# Altium schematic sheet RadiationMainSheet.SchDoc
size A4
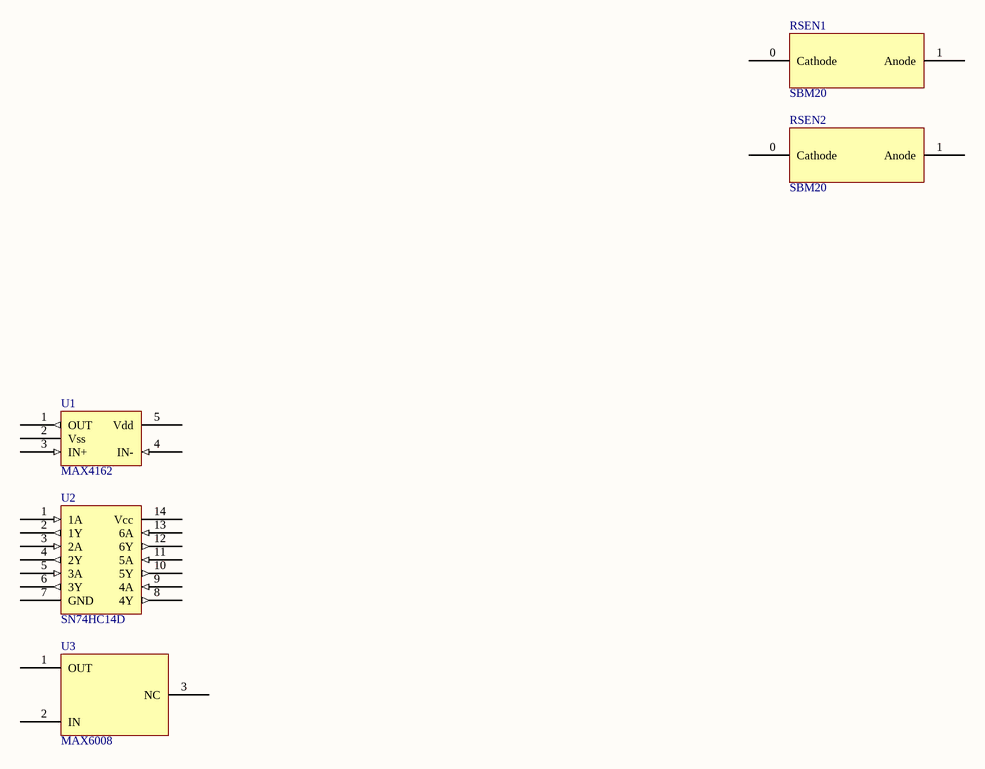
[diagram p0: RadiationMainSheet.SchDoc]

## Parts
RSEN1  SBM20  [SBM20_ITS]
RSEN2  SBM20  [SBM20_ITS]
U1  MAX4162  [SOT95P280X145-5N_ITS]
U2  SN74HC14D  [SOIC127P600X175-14N_ITS]
U3  MAX6008  [SOT95P237X112-3N_ITS]

## Nets

Not connected (* = marked no-connect by the designer): RSEN1 0(Cathode) 1(Anode); RSEN2 0(Cathode) 1(Anode); U1 1(OUT) 2(Vss) 3(IN+) 4(IN-) 5(Vdd); U2 1(1A) 2(1Y) 3(2A) 4(2Y) 5(3A) 6(3Y) 7(GND) 8(4Y) 9(4A) 10(5Y) 11(5A) 12(6Y) 13(6A) 14(Vcc); U3 1(OUT) 2(IN) 3(NC)

## Library data of the parts
U1 = MAX4162_ITS: ComponentLink2Description: Datasheet; ComponentLink2URL: http://datasheets.maximintegrated.com/en/ds/MAX4162-MAX4164.pdf
U2 = SN74HC14D_ITS
U3 = MAX6008_ITS